# Altium schematic sheet Sensors.SchDoc
size A4; SheetNumber: 1; SheetTotal: 2
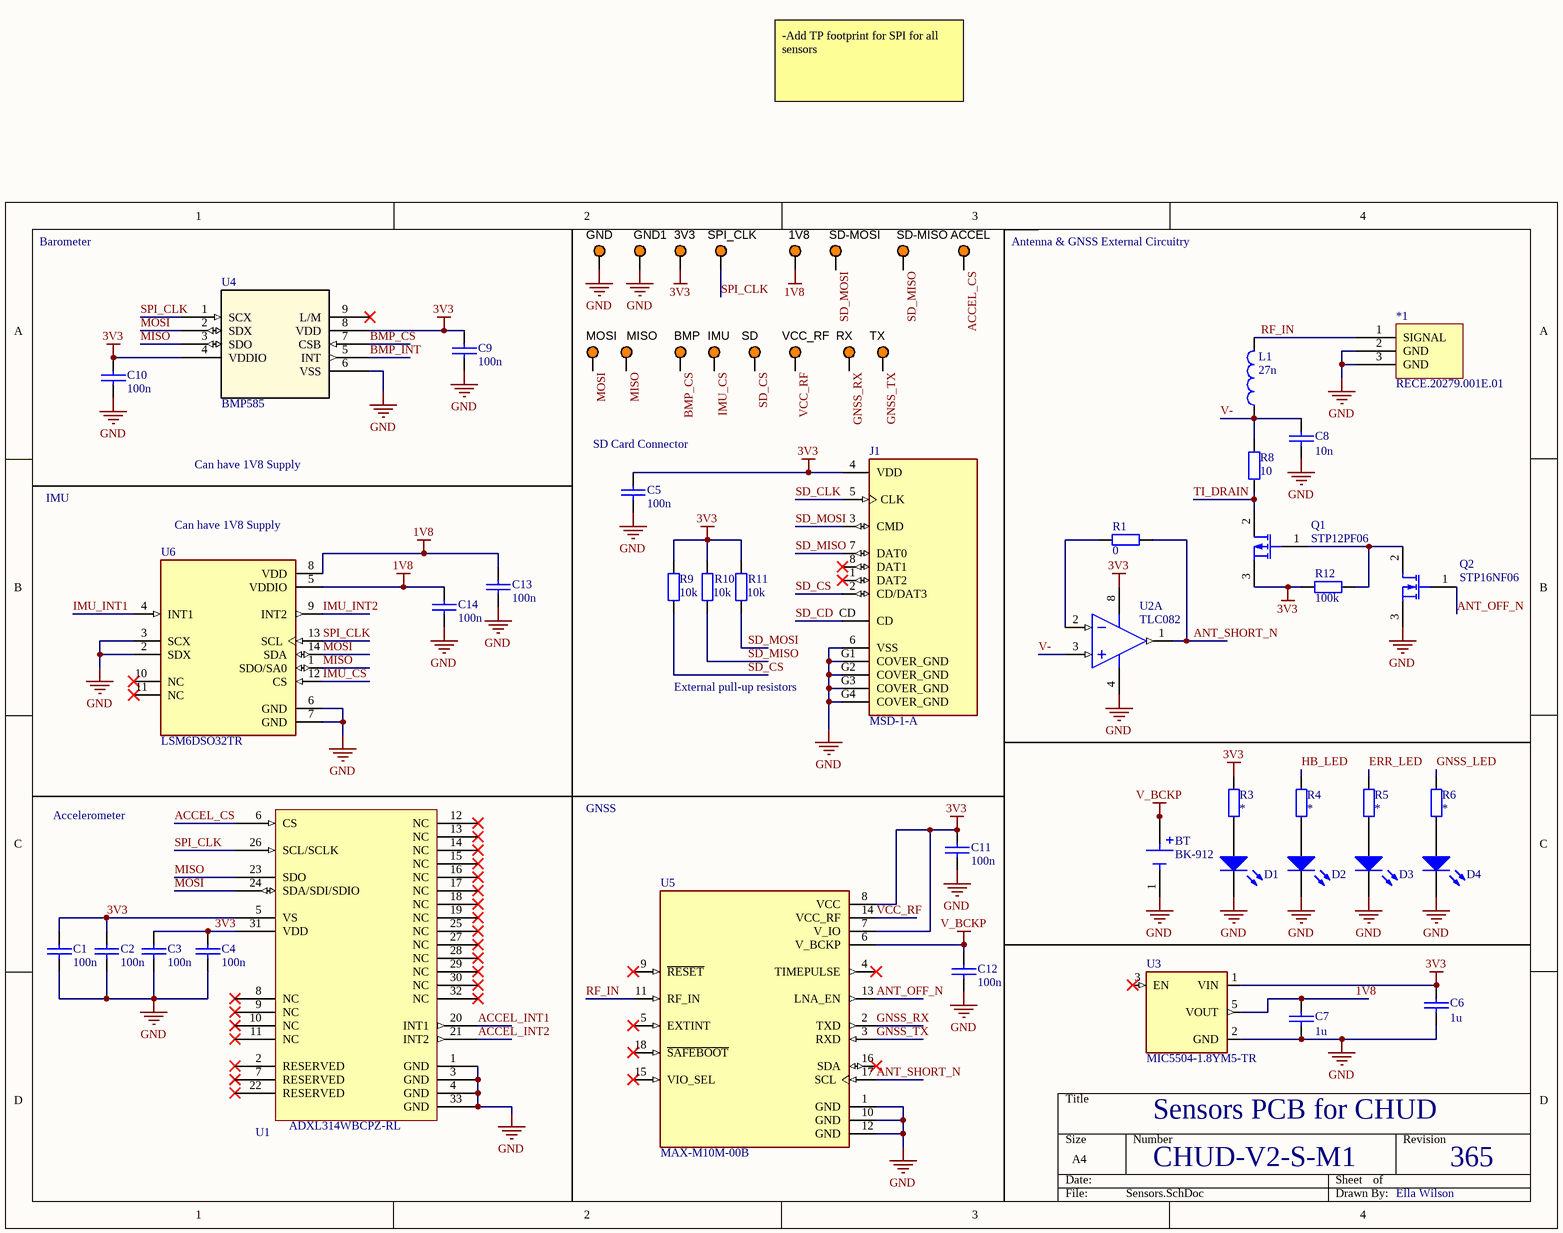
[diagram p0: Sensors.SchDoc]

## Parts
1V8  5003  [TP_TH]  (value not drawn)
3V3  5003  [TP_TH]  (value not drawn)
*1  RECE.20279.001E.01
ACCEL  5003  [TP_TH]  (value not drawn)
BMP  5003  [TP_TH]  (value not drawn)
BT  BK-912  [BAT_BK-912]
C1  100n  [0805 CAP]
C2  100n  [0805 CAP]
C3  100n  [0805 CAP]
C4  100n  [0805 CAP]
C5  100n  [0805 CAP]
C6  1u  [0805 CAP]
C7  1u  [0805 CAP]
C8  10n  [0805 CAP]
C9  100n  [0805 CAP]
C10  100n  [0805 CAP]
C11  100n  [0805 CAP]
C12  100n  [0805 CAP]
C13  100n  [0805 CAP]
C14  100n  [0805 CAP]
D1  LTST-C170KGKT  [0805 LED]  (value not drawn)
D2  LTST-C170KGKT  [0805 LED]  (value not drawn)
D3  LTST-C170KGKT  [0805 LED]  (value not drawn)
D4  LTST-C170KGKT  [0805 LED]  (value not drawn)
GND  5003  [TP_TH]  (value not drawn)
GND1  5003  [TP_TH]  (value not drawn)
IMU  5003  [TP_TH]  (value not drawn)
J1  MSD-1-A  [CUI_MSD-1-A]
L1  27n  [ece-INDUCTOR1005]
MISO  5003  [TP_TH]  (value not drawn)
MOSI  5003  [TP_TH]  (value not drawn)
Q1  STP12PF06  [ece-TO220]
Q2  STP16NF06  [ece-TO220]
R1  0  [0805 RES]
R3  *  [0805 RES]
R4  *  [0805 RES]
R5  *  [0805 RES]
R6  *  [0805 RES]
R8  10  [0805 RES]
R9  10k  [0805 RES]
R10  10k  [0805 RES]
R11  10k  [0805 RES]
R12  100k  [0805 RES]
RX  5003  [TP_TH]  (value not drawn)
SD  5003  [TP_TH]  (value not drawn)
SD-MISO  5003  [TP_TH]  (value not drawn)
SD-MOSI  5003  [TP_TH]  (value not drawn)
SPI_CLK  5003  [TP_TH]  (value not drawn)
TX  5003  [TP_TH]  (value not drawn)
U1  ADXL314WBCPZ-RL
U2  TLC082  [SO - 8]  (part A of 2)
U3  MIC5504-1.8YM5-TR  [SOT23-5P95_280X145XL45X37N]
U4  BMP585  [LGA9_BMP585_BOS]
U5  MAX-M10M-00B  [XCVR_MAX-M10M-00B]
U6  LSM6DSO32TR  [XDCR_LSM6DSO32TR]
VCC_RF  5003  [TP_TH]  (value not drawn)

## Nets
1V8: 1V8.1 C7.1 C13.1 C14.1 U3.5(VOUT) U6.5(VDDIO) U6.8(VDD)
3V3: 3V3.1 C1.1 C2.1 C3.1 C4.1 C5.1 C6.1 C9.1 C10.1 C11.1 J1.4(VDD) Q1.3(S) R3.2 R9.1 R10.2 R11.2 R12.2 U1.5(VS) U1.31(VDD) U2.8(VDD) U3.1(VIN) U4.4(VDDIO) U4.8(VDD) U5.7(V_IO) U5.8(VCC)
GND: *1.2(GND) *1.3(GND) BT.1(NEG) C1.2 C2.2 C3.2 C4.2 C5.2 C6.2 C7.2 C8.2 C9.2 C10.2 C11.2 C12.2 C13.2 C14.2 D1.2(K) D2.2(K) D3.2(K) D4.2(K) GND.1 GND1.1 J1.6(VSS) J1.G1(COVER_GND) J1.G2(COVER_GND) J1.G3(COVER_GND) J1.G4(COVER_GND) Q2.3(S) U1.1(GND) U1.3(GND) U1.4(GND) U1.33(GND) U2.4(VSS) U3.2(GND) U4.6(VSS) U5.1(GND) U5.10(GND) U5.12(GND) U6.2(SDX) U6.3(SCX) U6.6(GND) U6.7(GND)
V_BCKP: BT.S1(POS) BT.S2(POS) C12.1 U5.6(V_BCKP)
ACCEL_CS: ACCEL.1 U1.6(CS)
ACCEL_INT1: U1.20(INT1)
ACCEL_INT2: U1.21(INT2)
ANT_OFF_N: Q2.1(G) U5.13(LNA_EN)
ANT_SHORT_N: R1.1 U2.1(VOUTA) U5.17(SCL)
BMP_CS: BMP.1 U4.7(CSB)
BMP_INT: U4.5(INT)
ERR_LED: R5.2
GNSS_LED: R6.2
GNSS_RX: RX.1 U5.2(TXD)
GNSS_TX: TX.1 U5.3(RXD)
HB_LED: R4.2
IMU_CS: IMU.1 U6.12(CS)
IMU_INT1: U6.4(INT1)
IMU_INT2: U6.9(INT2)
MISO: MISO.1 U1.23(SDO) U4.3(SDO) U6.1(SDO/SA0)
MOSI: MOSI.1 U1.24(SDA/SDI/SDIO) U4.2(SDX) U6.14(SDA)
RF_IN: *1.1(SIGNAL) L1.2 U5.11(RF_IN)
SD_CD: J1.CD
SD_CLK: J1.5(CLK)
SD_CS: J1.2(CD/DAT3) R9.2 SD.1
SD_MISO: J1.7(DAT0) R10.1 SD-MISO.1
SD_MOSI: J1.3(CMD) R11.1 SD-MOSI.1
SPI_CLK: SPI_CLK.1 U1.26(SCL/SCLK) U4.1(SCX) U6.13(SCL)
TI_DRAIN: Q1.2(D) R8.1
V-: C8.1 L1.1 R8.2 U2.3(VINA+)
VCC_RF: U5.14(VCC_RF) VCC_RF.1
NetD1_1: D1.1(A) R3.1
NetD2_1: D2.1(A) R4.1
NetD3_1: D3.1(A) R5.1
NetD4_1: D4.1(A) R6.1
NetQ1_1: Q1.1(G) Q2.2(D) R12.1
NetR1_2: R1.2 U2.2(VINA-)

Not connected (* = marked no-connect by the designer): J1 1(DAT2)* 8(DAT1)*; U1 2(RESERVED)* 7(RESERVED)* 8(NC)* 9(NC)* 10(NC)* 11(NC)* 12(NC)* 13(NC)* 14(NC)* 15(NC)* 16(NC)* 17(NC)* 18(NC)* 19(NC)* 22(RESERVED)* 25(NC)* 27(NC)* 28(NC)* 29(NC)* 30(NC)* 32(NC)*; U3 3(EN)*; U4 9(L/M)*; U5 4(TIMEPULSE)* 5(EXTINT)* 9(~{RESET})* 15(VIO_SEL)* 16(SDA)* 18(~{SAFEBOOT})*; U6 10(NC)* 11(NC)*

## Notes on the sheet
- -Add TP footprint for SPI for all sensors
- Barometer
- (near ACCEL) Antenna & GNSS External Circuitry
- (near C5) SD Card Connector
- IMU
- Can have 1V8 Supply
- (near U6) Can have 1V8 Supply
- (near J1) External pull-up resistors
- Accelerometer
- GNSS
- Sensors PCB for CHUD
- CHUD-V2-S-M1
- 365
- Ella Wilson

## Library data of the parts
1V8 3V3 ACCEL BMP GND GND1 IMU MISO MOSI RX SD SD-MISO SD-MOSI SPI_CLK TX VCC_RF = TestPoint: Test Point, Orange, 1-Pin THD, RoHS; Peak Reverse Current: 600 uA; Forward Current: 3 A; Max Surge Current: 80 A; Forward Voltage: 1.08 V; Max Operating Temperature: 150 degC; PackageReference: 5003; Pins: 2; ComponentLink2URL: http://keyelco.com/userAssets/file/M65p56.pdf; PackageDescription: 1-Pin Through Hole Device, Dia 2.54 mm; Weight: 0.01 lb; Diameter: 5.3 mm; Mount: Through Hole; Package Quantity: 500; Packaging: Bulk; Min Operating Temperature: -65 degC; ComponentLink1Description: Manufacturer URL; Height: 0.25 inch; ComponentLink1URL: http://www.keyelco.com/; ComponentLink2Description: Datasheet; Width: 0.25 inch; REACH SVHC: No SVHC; RoHSCompliant: true; Radiation Hardening: No; Length: 9.5 mm; DatasheetVersion: Jun-15
BT = BK-912: BATTERY RETAINER COIN 20MM SMD; MF: MPD; Value: *; Price: None; Package: None; SnapEDA_Link: https://www.snapeda.com/parts/BK-912/Memory%20Protection%20Devices/view-part/4219672/?ref=snap; Availability: Unavailable; MP: BK-912
C1-C14 = CerCap_SMT_0805: SMT ceramic capacitor 0805 size; Value: *
D1-D4 = LED_SMT_0805: SMT LED 0805 size; Manufacturer: Lite-On Inc.; Color: Green; Lens Color: Colorless; Lens Transparency: Clear; Millicandela Rating: 35mcd; Lens Style/Size: Rectangle with Flat Top, 1.40mm x 1.25mm; Voltage - Forward (Vf) (Typ): 2V; Current - Test: 20mA; Viewing Angle: 130°; Wavelength - Dominant: 571nm; Wavelength - Peak: 574nm; Supplier 1: Digi-Key; Manufacturer Part Number: LTST-C170KGKT; RoHS: RoHS Compliant; Category: Optoelectronics; Stock 1: 503069; Pricing 1: 1=0.62, 10=0.459, 25=0.338, 100=0.2415, 250=0.16416, 500=0.14486, 1000=0.11347 (NZD); Packaging: Cut Tape (CT); Part Status: Active; Mounting Type: Surface Mount; Features: -; Package / Case: 0805 (2012 Metric); Size / Dimension: 2.00mm L x 1.25mm W; Height (Max): 1.10mm; ComponentLink1URL: http://optoelectronics.liteon.com/upload/download/DS22-2000-073/LTST-C170KGKT.pdf; ComponentLink1Description: http://optoelectronics.liteon.com/upload/download/DS22-2000-073/LTST-C170KGKT.pdf; Supplier Part Number 1: 160-1414-1-ND
J1 = MSD-1-A: Micro SD Card Connector, 9 Positions, Connector and Ejector, Push In, Auto Eject Out, Surface Mount, 1.8 mm Height Above Board, Gold Flash; MF: Same Sky; SnapEDA_Link: https://www.snapeda.com/parts/MSD-1-A/Same+Sky/view-part/?ref=snap; Package: None; Value: *; MP: MSD-1-A; Check_prices: https://www.snapeda.com/parts/MSD-1-A/Same+Sky/view-part/?ref=eda
L1 = Inductor: inductor Surface Mount; Value: *
Q1 = STP12P: P channel MOSFET; Value: STP12PF06
Q2 = STP16N: N channel MOSFET; Value: STP16NF06
R1 R3-R6 R8-R12 = Res_SMT_0805: 0805 resistor; Published: 8-Jun-2000; LatestRevisionDate: 17-Jul-2002; LatestRevisionNote: Re-released for DXP Platform.; PackageReference: AXIAL-0.4; Publisher: Altium Limited; Value: *; ComponentLink1Description: https://nz.mouser.com/datasheet/2/315/AOA0000C304-1149620.pdf
U2 = TLC082_SMT_SOIC8: IC OPAMP GP 10MHZ 8SOIC; Manufacturer: Texas Instruments; Manufacturer Part Number: TLC082CDR; Amplifier Type: General Purpose; Slew Rate: 19 V/µs; Current - Supply: 1.9mA; Voltage - Supply, Single/Dual (±): 4.5 V ~ 16 V, ±2.25 V ~ 8 V; Supplier 1: Digi-Key; RoHS: RoHS Compliant; Category: Integrated Circuits (ICs); Stock 1: 29765; Pricing 1: 1=3.44, 10=3.087, 100=2.4808, 500=2.03822, 1000=1.68881 (NZD); Packaging: Cut Tape (CT); Part Status: Active; Output Type: -; Operating Temperature: 0°C ~ 70°C; Mounting Type: Surface Mount; Package / Case: 8-SOIC (0.154", 3.90mm Width); Supplier Device Package: 8-SOIC; Base Part Number: TLC082; ComponentLink1URL: http://www.ti.com/lit/ds/symlink/tlc080a.pdf; ComponentLink1Description: http://www.ti.com/lit/ds/symlink/tlc080a.pdf; Supplier Part Number 1: 296-2421-1-ND
U3 = MIC5504-1.8YM5-TR: Linear Voltage Regulator IC Positive Fixed 1 Output 300mA SOT-23-5; MF: Microchip; SnapEDA_Link: https://www.snapeda.com/parts/MIC5504-1.8YM5-TR/Microchip/view-part/?ref=snap; Package: SOT-23 Microchip; Value: *; MP: MIC5504-1.8YM5-TR; Check_prices: https://www.snapeda.com/parts/MIC5504-1.8YM5-TR/Microchip/view-part/?ref=eda
U4 = BMP585: Description; Manufacturer_Name: Bosch Sensortec; Type: Pressure Sensors, Transducers; Copyright: Copyright (C) 2026 Ultra Librarian. All rights reserved.; Manufacturer_Part_Number: BMP585; RefDes: RefDes
U5 = MAX-M10M-00B: MAX-M10 RF Receiver BeiDou, Galileo, GLONASS, GNSS, GPS -164dBm Not Included; MF: u-blox; SnapEDA_Link: https://www.snapeda.com/parts/MAX-M10M-00B/u-blox/view-part/?ref=snap; Package: None; Value: *; MP: MAX-M10M-00B; Check_prices: https://www.snapeda.com/parts/MAX-M10M-00B/u-blox/view-part/?ref=eda
U6 = LSM6DSO32TR: Accelerometer, Gyroscope, Temperature, 6 Axis Sensor IÂ²C, SPI Output; MF: STMicroelectronics; SnapEDA_Link: https://www.snapeda.com/parts/LSM6DSO32TR/STMicroelectronics/view-part/?ref=snap; Package: VFLGA-14 STMicroelectronics; Value: *; MP: LSM6DSO32TR; Check_prices: https://www.snapeda.com/parts/LSM6DSO32TR/STMicroelectronics/view-part/?ref=eda